# Altium schematic sheet UWB-Adapter_Sch.SchDoc: UWB Adapter
size 228 x 152 mm; Author: Hom; CompanyName: KitSprout; DrawnBy: Hom; Engineer: Hom; Organization: KitSprout; Revision: A; SheetNumber: 1; SheetTotal: 1; Version: 1.4; LibVersion: 2.13; PageSetup: Record=PageOptions|CenterHorizontal=True|CenterVertical=True|PrintScale=1.00|XCorrection=1.00|YCorrection=1.00|PrintKind=0|BorderSize=5000000|LeftOffset=0|BottomOffset=0|Orientation=2|PaperLength=1000|PaperWidth=1000|Scale=100|PaperSource=7|PrintQuality=-3|MediaType=1|DitherType=10|PrintScaleMode=0|PaperKind=PostScript 自訂頁面大小¦PaperIndex=32767
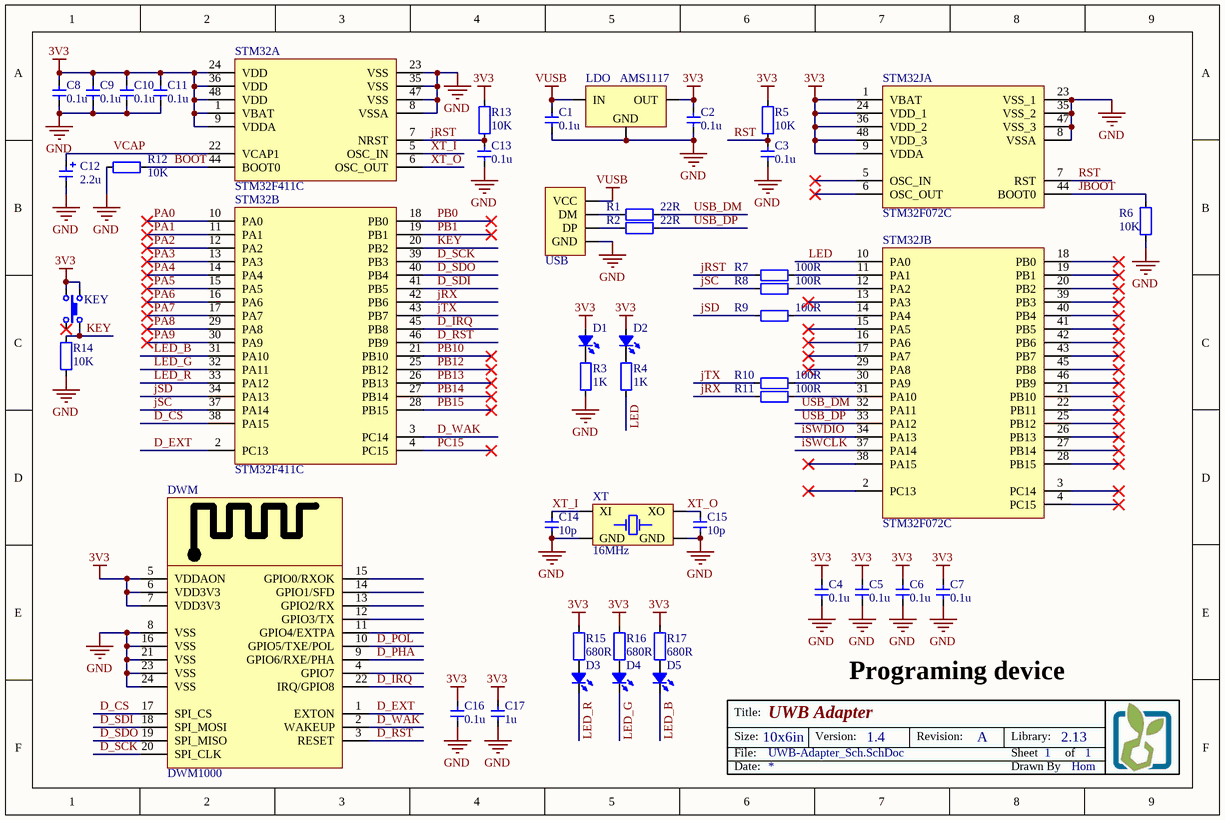
[diagram p0: UWB-Adapter_Sch.SchDoc]

## Parts
C1  value 0.1u  [CAP_0603]  (hidden comment: Cap_0603)
C2  value 0.1u  [CAP_0603]  (hidden comment: Cap_0603)
C3  value 0.1u  [CAP_0603]  (hidden comment: Cap_0603)
C4  value 0.1u  [CAP_0603]  (hidden comment: Cap_0603)
C5  value 0.1u  [CAP_0603]  (hidden comment: Cap_0603)
C6  value 0.1u  [CAP_0603]  (hidden comment: Cap_0603)
C7  value 0.1u  [CAP_0603]  (hidden comment: Cap_0603)
C8  value 0.1u  [CAP_0603]  (hidden comment: Cap_0603)
C9  value 0.1u  [CAP_0603]  (hidden comment: Cap_0603)
C10  value 0.1u  [CAP_0603]  (hidden comment: Cap_0603)
C11  value 0.1u  [CAP_0603]  (hidden comment: Cap_0603)
C12  value 2.2u  [CAP_TAN_P0805]  (hidden comment: Cap_Tan_0805)
C13  value 0.1u  [CAP_0603]  (hidden comment: Cap_0603)
C14  value 10p  [CAP_0603]  (hidden comment: Cap_0603)
C15  value 10p  [CAP_0603]  (hidden comment: Cap_0603)
C16  value 0.1u  [CAP_0603]  (hidden comment: Cap_0603)
C17  value 1u  [CAP_0603]  (hidden comment: Cap_0603)
D1  LED_0603  [LED_0603_YELLOW]  (value not drawn)
D2  LED_0603  [LED_0603_ORANGE]  (value not drawn)
D3  LED_0603  [LED_0603_RED]  (value not drawn)
D4  LED_0603  [LED_0603_GREEN]  (value not drawn)
D5  LED_0603  [LED_0603_BLUE]  (value not drawn)
DWM  DWM1000  [DWM1000]
KEY  ButtonTACT  [ButtonTACT_3.5*3.55_90]  (value not drawn)
LDO  AMS1117  [SOT89-3]
R1  value 22R  [RES_0603]  (hidden comment: Res_0603)
R2  value 22R  [RES_0603]  (hidden comment: Res_0603)
R3  value 1K  [RES_0603]  (hidden comment: Res_0603)
R4  value 1K  [RES_0603]  (hidden comment: Res_0603)
R5  value 10K  [RES_0603]  (hidden comment: Res_0603)
R6  value 10K  [RES_0603]  (hidden comment: Res_0603)
R7  value 100R  [RES_0603]  (hidden comment: Res_0603)
R8  value 100R  [RES_0603]  (hidden comment: Res_0603)
R9  value 100R  [RES_0603]  (hidden comment: Res_0603)
R10  value 100R  [RES_0603]  (hidden comment: Res_0603)
R11  value 100R  [RES_0603]  (hidden comment: Res_0603)
R12  value 10K  [RES_0603]  (hidden comment: Res_0603)
R13  value 10K  [RES_0603]  (hidden comment: Res_0603)
R14  value 10K  [RES_0603]  (hidden comment: Res_0603)
R15  value 680R  [RES_0603]  (hidden comment: Res_0603)
R16  value 680R  [RES_0603]  (hidden comment: Res_0603)
R17  value 680R  [RES_0603]  (hidden comment: Res_0603)
STM32  STM32F411C  [QFN_P0.5_48]  (parts A,B of 2)
STM32J  STM32F072C  [LQFP_P0.5_48]  (parts A,B of 2)
USB  USB_Plug_TypeA  [USB_Plug_TypeA]  (value not drawn)
XT  value 16MHz  [XT_2520_4]  (hidden comment: XTAL_2520_4P)

## Nets
3V3: C2.2 C4.2 C5.2 C6.2 C7.2 C8.2 C9.2 C10.2 C11.2 C16.1 C17.1 D1.1(A) D2.1(A) DWM.5(VDDAON) DWM.6(VDD3V3) DWM.7(VDD3V3) KEY.1 KEY.3 LDO.2(OUT) R5.2 R13.2 R15.2 R16.2 R17.2 STM32.1(VBAT) STM32.9(VDDA) STM32.24(VDD) STM32.36(VDD) STM32.48(VDD) STM32J.1(VBAT) STM32J.9(VDDA) STM32J.24(VDD_1) STM32J.36(VDD_2) STM32J.48(VDD_3)
GND: C1.1 C2.1 C3.1 C4.1 C5.1 C6.1 C7.1 C8.1 C9.1 C10.1 C11.1 C12.2 C13.1 C14.1 C15.1 C16.2 C17.2 DWM.8(VSS) DWM.16(VSS) DWM.21(VSS) DWM.23(VSS) DWM.24(VSS) LDO.1(GND) R3.1 R6.1 R12.2 R14.1 STM32.8(VSSA) STM32.23(VSS) STM32.35(VSS) STM32.47(VSS) STM32J.8(VSSA) STM32J.23(VSS_1) STM32J.35(VSS_2) STM32J.47(VSS_3) USB.4(GND) XT.2(GND) XT.4(GND)
VUSB: C1.2 LDO.3(IN) USB.1(VCC)
BOOT: R12.1 STM32.44(BOOT0)
D_CS: DWM.17(SPI_CS) STM32.38(PA15)
D_EXT: DWM.1(EXTON) STM32.2(PC13)
D_IRQ: DWM.22(IRQ/GPIO8) STM32.45(PB8)
D_PHA: DWM.9(GPIO6/RXE/PHA)
D_POL: DWM.10(GPIO5/TXE/POL)
D_RST: DWM.3(RESET) STM32.46(PB9)
D_SCK: DWM.20(SPI_CLK) STM32.39(PB3)
D_SDI: DWM.18(SPI_MOSI) STM32.41(PB5)
D_SDO: DWM.19(SPI_MISO) STM32.40(PB4)
D_WAK: DWM.2(WAKEUP) STM32.3(PC14)
iSWCLK: STM32J.37(PA14)
iSWDIO: STM32J.34(PA13)
JBOOT: R6.2 STM32J.44(BOOT0)
jRST: C13.2 R7.1 R13.1 STM32.7(NRST)
jRX: R11.1 STM32.42(PB6)
jSC: R8.1 STM32.37(PA14)
jSD: R9.1 STM32.34(PA13)
jTX: R10.1 STM32.43(PB7)
KEY: KEY.2 R14.2 STM32.20(PB2)
LED: R4.1 STM32J.10(PA0)
LED_B: D5.2(K) STM32.31(PA10)
LED_G: D4.2(K) STM32.32(PA11)
LED_R: D3.2(K) STM32.33(PA12)
PA0: STM32.10(PA0)
PA1: STM32.11(PA1)
PA2: STM32.12(PA2)
PA3: STM32.13(PA3)
PA4: STM32.14(PA4)
PA5: STM32.15(PA5)
PA6: STM32.16(PA6)
PA7: STM32.17(PA7)
PA8: STM32.29(PA8)
PA9: STM32.30(PA9)
PB0: STM32.18(PB0)
PB1: STM32.19(PB1)
P~{B}10: STM32.21(PB10)
P~{B}12: STM32.25(PB12)
P~{B}13: STM32.26(PB13)
P~{B}14: STM32.27(PB14)
P~{B}15: STM32.28(PB15)
PC15: STM32.4(PC15)
RST: C3.2 R5.1 STM32J.7(RST)
USB_DM: R1.2 STM32J.32(PA11)
USB_DP: R2.2 STM32J.33(PA12)
VCAP: C12.1 STM32.22(VCAP1)
XT_I: C14.2 STM32.5(OSC_IN) XT.1(XI)
XT_O: C15.2 STM32.6(OSC_OUT) XT.3(XO)
NetD1_2: D1.2(K) R3.2
NetD2_2: D2.2(K) R4.2
NetD3_1: D3.1(A) R15.1
NetD4_1: D4.1(A) R16.1
NetD5_1: D5.1(A) R17.1
NetR1_1: R1.1 USB.2(DM)
NetR2_1: R2.1 USB.3(DP)
NetR7_2: R7.2 STM32J.11(PA1)
NetR8_2: R8.2 STM32J.12(PA2)
NetR9_2: R9.2 STM32J.14(PA4)
NetR10_2: R10.2 STM32J.30(PA9)
NetR11_2: R11.2 STM32J.31(PA10)

Not connected (* = marked no-connect by the designer): DWM 4(GPIO7) 11(GPIO4/EXTPA) 12(GPIO3/TX) 13(GPIO2/RX) 14(GPIO1/SFD) 15(GPIO0/RXOK); KEY 4*; STM32J 2(PC13)* 3(PC14)* 4(PC15)* 5(OSC_IN)* 6(OSC_OUT)* 13(PA3)* 15(PA5)* 16(PA6)* 17(PA7)* 18(PB0)* 19(PB1)* 20(PB2)* 21(PB10)* 22(PB11)* 25(PB12)* 26(PB13)* 27(PB14)* 28(PB15)* 29(PA8)* 38(PA15)* 39(PB3)* 40(PB4)* 41(PB5)* 42(PB6)* 43(PB7)* 45(PB8)* 46(PB9)*

## Notes on the sheet
- Programing device
- Title:
- Size:
- Date:
- File:
- 10x6in
- Version:
- Revision:
- Sheet
- Drawn By
- Library:
- of

## Library data of the parts
C1-C11 C13-C17 = Cap_0603: Capacitor
C12 = Cap_Tan_0805: Capacitor
D1-D5 = LED_0603: LED
DWM = DWM1000: Module; Manufacturer: Decawave Limited; Frequency: 3.5GHz ~ 6.5GHz; Data Rate: 6.8Mbps; Serial Interfaces: SPI; Antenna Type: Integrated, Chip; Voltage - Supply: 2.8 V ~ 3.6 V; Current - Receiving: 64mA; Current - Transmitting: 31mA; Supplier 1: Digi-Key; Manufacturer Part Number: DWM1000; RoHS: RoHS Compliant; Category: RF/IF and RFID; Stock 1: 1028; Pricing 1: 1=32.16, 10=26.704, 100=24.24, 250=22.51296 (USD); Packaging: Cut Tape (CT); RF Family/Standard: 802.15.4; Protocol: -; Modulation: -; Power - Output: -; Sensitivity: -; Memory Size: -; Mounting Type: Surface Mount; Operating Temperature: -40°C ~ 85°C; Package / Case: Module; ComponentLink1URL: http://www.decawave.com/sites/default/files/product-pdf/dwm1000-product-brief.pdf; ComponentLink1Description: http://www.decawave.com/sites/default/files/product-pdf/dwm1000-product-brief.pdf; Supplier Part Number 1: 1479-1002-1-ND
KEY = ButtonTACT: Button
LDO = LDO1117: Power
R1-R17 = Res_0603: Resistor
STM32 = STM32F4x1C: MCU
STM32J = STM32F103C: MCU
USB = USB_Plug_TypeA: USB
XT = XTAL_2520_4P: Crystal Oscillator